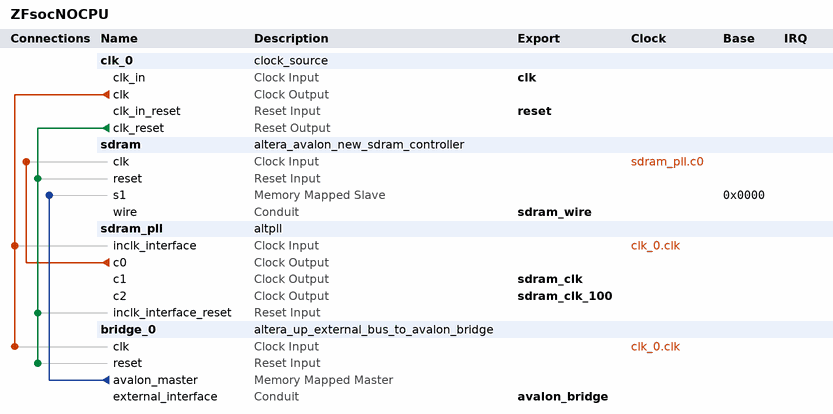
[diagram p0: system contents]
# Platform Designer (Qsys) system ZFsocNOCPU, MAX 10 10M50DAF484C7G
# Parameters at their usual value, and those the tool derives, are not listed.
package require -exact qsys 18.1
create_system ZFsocNOCPU
set_project_property DEVICE_FAMILY {MAX 10}
set_project_property DEVICE 10M50DAF484C7G

add_instance clk_0 clock_source 18.1
set_instance_parameter_value clk_0 clockFrequency 50000000

add_instance sdram altera_avalon_new_sdram_controller 18.1
set_instance_parameter_value sdram TAC 5.4
set_instance_parameter_value sdram TRCD 20.0
set_instance_parameter_value sdram TRP 20.0
set_instance_parameter_value sdram casLatency 3
set_instance_parameter_value sdram columnWidth 10
set_instance_parameter_value sdram dataWidth 16
set_instance_parameter_value sdram generateSimulationModel false
set_instance_parameter_value sdram model single_Micron_MT48LC4M32B2_7_chip
set_instance_parameter_value sdram numberOfBanks 4
set_instance_parameter_value sdram numberOfChipSelects 1
set_instance_parameter_value sdram powerUpDelay 200.0
set_instance_parameter_value sdram refreshPeriod 15.625
set_instance_parameter_value sdram rowWidth 13

add_instance sdram_pll altpll 18.1
set_instance_parameter_value sdram_pll CLK0_DIVIDE_BY 1
set_instance_parameter_value sdram_pll CLK0_MULTIPLY_BY 1
set_instance_parameter_value sdram_pll CLK1_DIVIDE_BY 1
set_instance_parameter_value sdram_pll CLK1_DUTY_CYCLE 50
set_instance_parameter_value sdram_pll CLK1_MULTIPLY_BY 1
set_instance_parameter_value sdram_pll CLK1_PHASE_SHIFT -1000
set_instance_parameter_value sdram_pll CLK2_DIVIDE_BY 1
set_instance_parameter_value sdram_pll CLK2_DUTY_CYCLE 50
set_instance_parameter_value sdram_pll CLK2_MULTIPLY_BY 2
set_instance_parameter_value sdram_pll CLK2_PHASE_SHIFT -1000
set_instance_parameter_value sdram_pll INCLK0_INPUT_FREQUENCY 20000
set_instance_parameter_value sdram_pll PORT_ARESET PORT_UNUSED
set_instance_parameter_value sdram_pll PORT_LOCKED PORT_UNUSED
set_instance_parameter_value sdram_pll PORT_clk1 PORT_USED
set_instance_parameter_value sdram_pll PORT_clk2 PORT_USED
set_instance_parameter_value sdram_pll PORT_clk3 PORT_UNUSED

add_instance bridge_0 altera_up_external_bus_to_avalon_bridge 18.0
set_instance_parameter_value bridge_0 addr_size 64
set_instance_parameter_value bridge_0 addr_size_multiplier Mbytes
set_instance_parameter_value bridge_0 data_size 16

# connections
add_connection clk_0.clk bridge_0.clk clock
add_connection clk_0.clk sdram_pll.inclk_interface clock
add_connection sdram_pll.c0 sdram.clk clock
add_connection clk_0.clk_reset bridge_0.reset reset
add_connection clk_0.clk_reset sdram.reset reset
add_connection clk_0.clk_reset sdram_pll.inclk_interface_reset reset
add_connection bridge_0.avalon_master sdram.s1 avalon
set_connection_parameter_value bridge_0.avalon_master/sdram.s1 baseAddress 0x0000

# exported interfaces
add_interface avalon_bridge conduit end
set_interface_property avalon_bridge EXPORT_OF bridge_0.external_interface
add_interface clk clock sink
set_interface_property clk EXPORT_OF clk_0.clk_in
add_interface reset reset sink
set_interface_property reset EXPORT_OF clk_0.clk_in_reset
add_interface sdram_clk clock source
set_interface_property sdram_clk EXPORT_OF sdram_pll.c1
add_interface sdram_clk_100 clock source
set_interface_property sdram_clk_100 EXPORT_OF sdram_pll.c2
add_interface sdram_wire conduit end
set_interface_property sdram_wire EXPORT_OF sdram.wire

set_interconnect_requirement {$system} qsys_mm.clockCrossingAdapter HANDSHAKE
set_interconnect_requirement {$system} qsys_mm.enableEccProtection FALSE
set_interconnect_requirement {$system} qsys_mm.insertDefaultSlave FALSE
set_interconnect_requirement {$system} qsys_mm.maxAdditionalLatency 1

save_system ZFsocNOCPU.qsys
